# EAGLE design numpad (EAGLE 8.4.3)
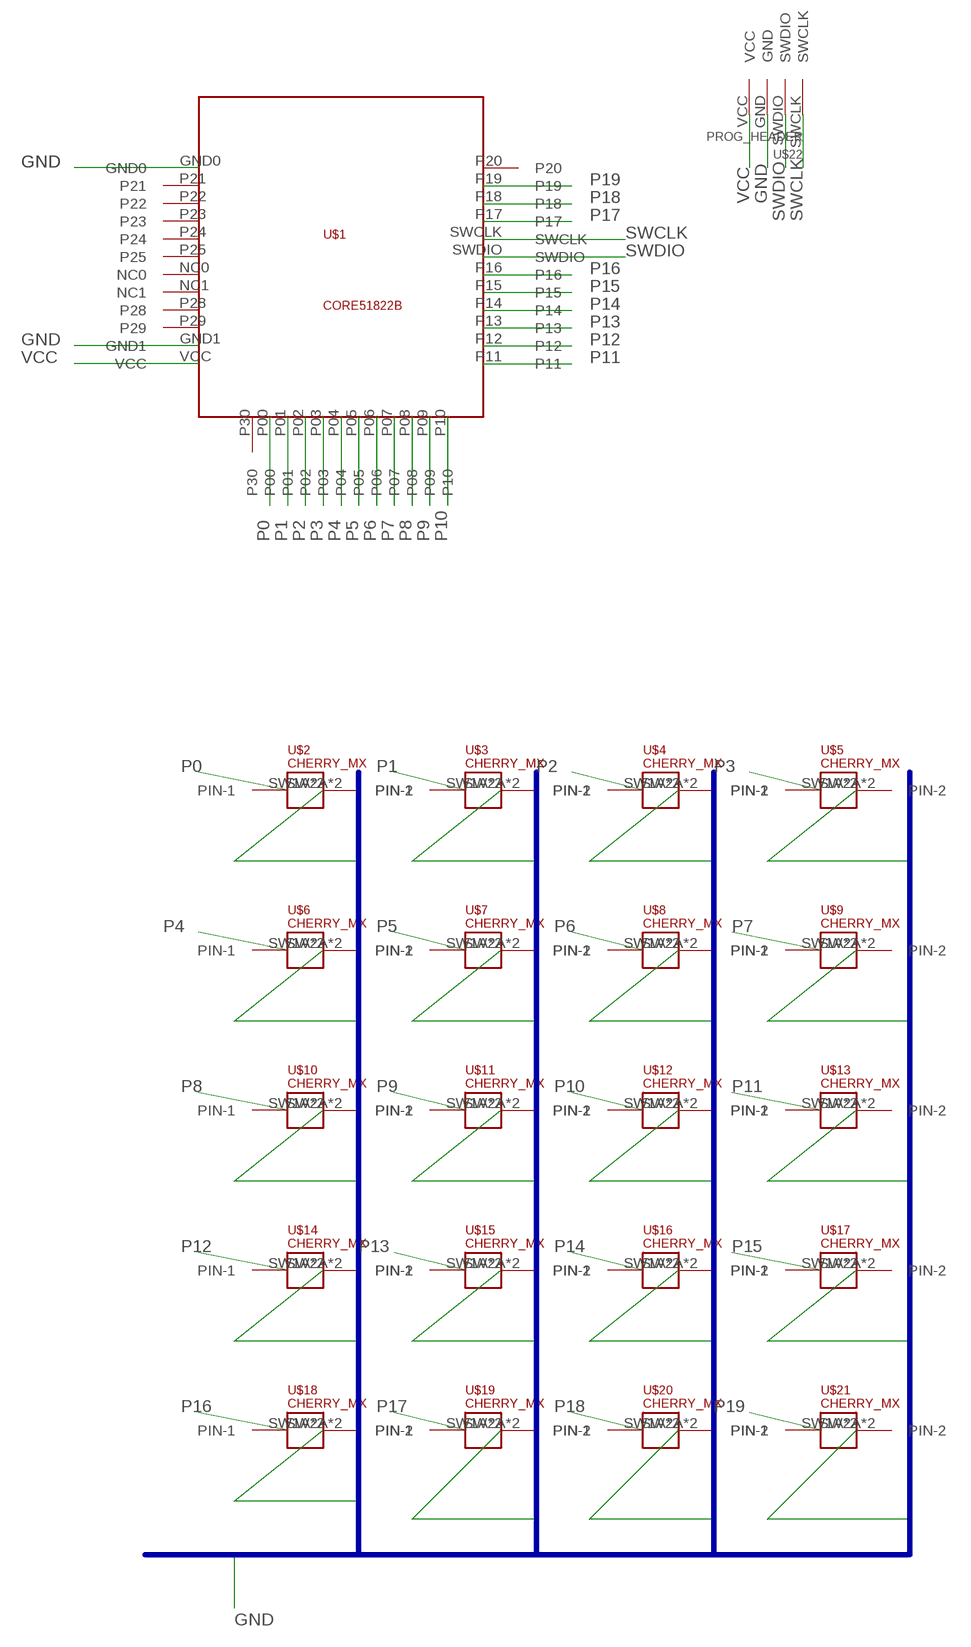
[diagram p0: schematic, sheet 1]

## Parts
U$1  CORE51822B  [CORE51822B]
U$2  CHERRY_MX  [CHERRY_MX]
U$3  CHERRY_MX  [CHERRY_MX]
U$4  CHERRY_MX  [CHERRY_MX]
U$5  CHERRY_MX  [CHERRY_MX]
U$6  CHERRY_MX  [CHERRY_MX]
U$7  CHERRY_MX  [CHERRY_MX]
U$8  CHERRY_MX  [CHERRY_MX]
U$9  CHERRY_MX  [CHERRY_MX]
U$10  CHERRY_MX  [CHERRY_MX]
U$11  CHERRY_MX  [CHERRY_MX]
U$12  CHERRY_MX  [CHERRY_MX]
U$13  CHERRY_MX  [CHERRY_MX]
U$14  CHERRY_MX  [CHERRY_MX]
U$15  CHERRY_MX  [CHERRY_MX]
U$16  CHERRY_MX  [CHERRY_MX]
U$17  CHERRY_MX  [CHERRY_MX]
U$18  CHERRY_MX  [CHERRY_MX]
U$19  CHERRY_MX  [CHERRY_MX]
U$20  CHERRY_MX  [CHERRY_MX]
U$21  CHERRY_MX  [CHERRY_MX]
U$22  PROG_HEADER  [PROG_HEADER]

## Nets
B$1: U$2.SW2A(PIN-2) U$2.SW2B(PIN-2) U$3.SW2A(PIN-2) U$3.SW2B(PIN-2) U$4.SW2A(PIN-2) U$4.SW2B(PIN-2) U$5.SW2A(PIN-2) U$5.SW2B(PIN-2) U$6.SW2A(PIN-2) U$6.SW2B(PIN-2) U$7.SW2A(PIN-2) U$7.SW2B(PIN-2) U$8.SW2A(PIN-2) U$8.SW2B(PIN-2) U$9.SW2A(PIN-2) U$9.SW2B(PIN-2) U$10.SW2A(PIN-2) U$10.SW2B(PIN-2) U$11.SW2A(PIN-2) U$11.SW2B(PIN-2) U$12.SW2A(PIN-2) U$12.SW2B(PIN-2) U$13.SW2A(PIN-2) U$13.SW2B(PIN-2) U$14.SW2A(PIN-2) U$14.SW2B(PIN-2) U$15.SW2A(PIN-2) U$15.SW2B(PIN-2) U$16.SW2A(PIN-2) U$16.SW2B(PIN-2) U$17.SW2A(PIN-2) U$17.SW2B(PIN-2) U$18.SW2A(PIN-2) U$18.SW2B(PIN-2) U$19.SW2A(PIN-2) U$19.SW2B(PIN-2) U$20.SW2A(PIN-2) U$20.SW2B(PIN-2) U$21.SW2A(PIN-2) U$21.SW2B(PIN-2)
GND: U$1.GND0 U$1.GND1 U$22.GND
P0: U$1.P00 U$2.SW1A(PIN-1) U$2.SW1B(PIN-1)
P1: U$1.P01 U$3.SW1A(PIN-1) U$3.SW1B(PIN-1)
P2: U$1.P02 U$4.SW1A(PIN-1) U$4.SW1B(PIN-1)
P3: U$1.P03 U$5.SW1A(PIN-1) U$5.SW1B(PIN-1)
P4: U$1.P04 U$6.SW1A(PIN-1) U$6.SW1B(PIN-1)
P5: U$1.P05 U$7.SW1A(PIN-1) U$7.SW1B(PIN-1)
P6: U$1.P06 U$8.SW1A(PIN-1) U$8.SW1B(PIN-1)
P7: U$1.P07 U$9.SW1A(PIN-1) U$9.SW1B(PIN-1)
P8: U$1.P08 U$10.SW1A(PIN-1) U$10.SW1B(PIN-1)
P9: U$1.P09 U$11.SW1A(PIN-1) U$11.SW1B(PIN-1)
P10: U$1.P10 U$12.SW1A(PIN-1) U$12.SW1B(PIN-1)
P11: U$1.P11 U$13.SW1A(PIN-1) U$13.SW1B(PIN-1)
P12: U$1.P12 U$14.SW1A(PIN-1) U$14.SW1B(PIN-1)
P13: U$1.P13 U$15.SW1A(PIN-1) U$15.SW1B(PIN-1)
P14: U$1.P14 U$16.SW1A(PIN-1) U$16.SW1B(PIN-1)
P15: U$1.P15 U$17.SW1A(PIN-1) U$17.SW1B(PIN-1)
P16: U$1.P16 U$18.SW1A(PIN-1) U$18.SW1B(PIN-1)
P17: U$1.P17 U$19.SW1A(PIN-1) U$19.SW1B(PIN-1)
P18: U$1.P18 U$20.SW1A(PIN-1) U$20.SW1B(PIN-1)
P19: U$1.P19 U$21.SW1A(PIN-1) U$21.SW1B(PIN-1)
SWCLK: U$1.SWCLK U$22.SWCLK
SWDIO: U$1.SWDIO U$22.SWDIO
VCC: U$1.VCC U$22.VCC
Unconnected: U$1.NC0 U$1.NC1 U$1.P20 U$1.P21 U$1.P22 U$1.P23 U$1.P24 U$1.P25 U$1.P28 U$1.P29 U$1.P30

## Buses
B$1

## Library data of the parts
U$1 = core51822b:CORE51822B: Core51822-b nRF51822 PCB
U$2-U$21 = cherry_mx:CHERRY_MX
U$22 = prog_header:PROG_HEADER

## Board
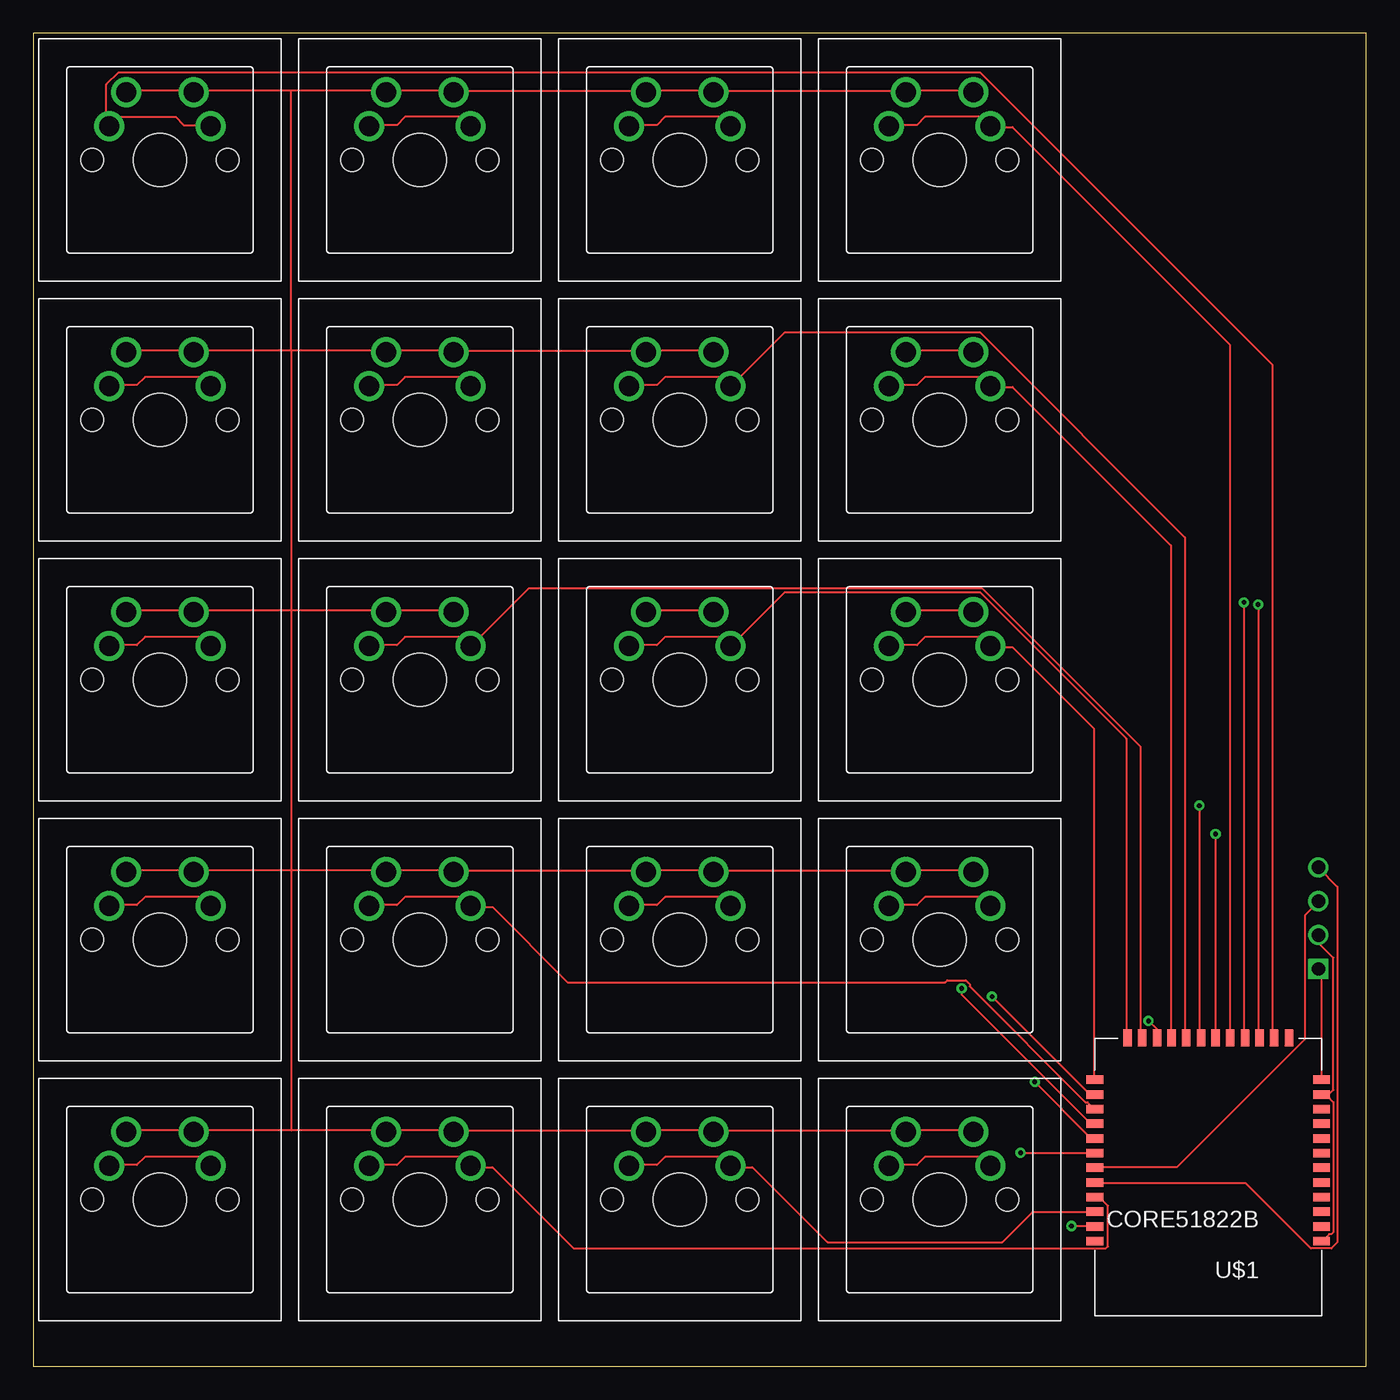
[diagram p1: board, top side]
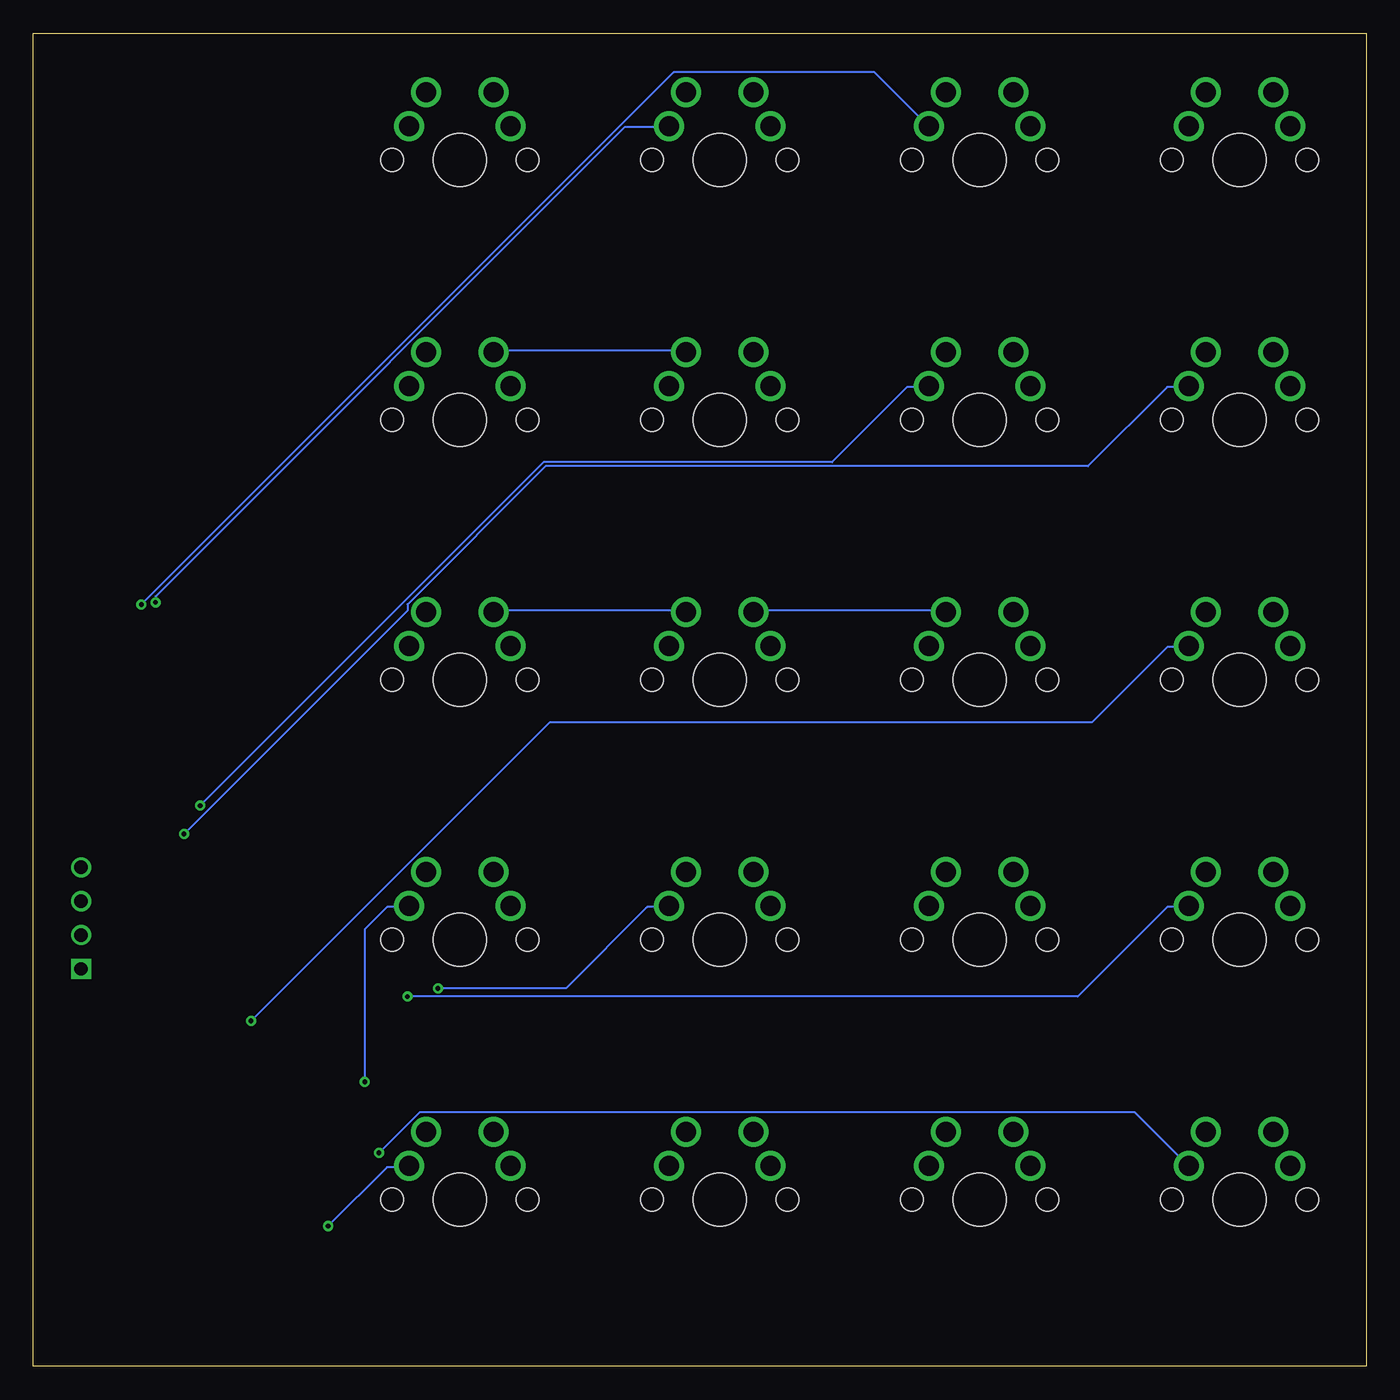
[diagram p2: board, bottom side, seen from below]

Size 100 x 100 mm. Coordinates in mm from the lower left corner, seen from the top.
Outline: 0,0 100,0 100,100 0,100 0,0
Copper layers (1*16): Top 0.035mm / dielectric 1.5mm / Bottom 0.035mm
Design rules "default": minimum track width 6mil, minimum drill 0.35mm, track to track 6mil, track to pad 6mil, pad to pad 6mil, via to via 6mil, smd to smd 6mil, copper to edge 40mil, drill to drill 6mil, minimum pad ring 10mil, minimum via ring 8mil, stop-mask expansion 4mil, vias tented up to drill 0mil, thermal gap 10mil

### Footprints (pad centres in the part's own frame; a part is rotated, then mirrored left to right if it is on the bottom)
CORE51822B = smd 1.27 x 0.635: GND0 -8.5,4.8; GND1 -8.5,-6.2; NC0 -8.5,-1.8; NC1 -8.5,-2.9; P11 8.5,-7.3; P12 8.5,-6.2; P13 8.5,-5.1; P14 8.5,-4; P15 8.5,-2.9; P16 8.5,-1.8; P17 8.5,1.5; P18 8.5,2.6; P19 8.5,3.7; P20 8.5,4.8; P21 -8.5,3.7; P22 -8.5,2.6; P23 -8.5,1.5; P24 -8.5,0.4; P25 -8.5,-0.7; P28 -8.5,-4; P29 -8.5,-5.1; SWCLK 8.5,0.4; SWDIO 8.5,-0.7; VCC -8.5,-7.3 | smd 0.635 x 1.27: P00 -4.95,-10.45; P01 -3.85,-10.45; P02 -2.75,-10.45; P03 -1.65,-10.45; P04 -0.55,-10.45; P05 0.55,-10.45; P06 1.65,-10.45; P07 2.75,-10.45; P08 3.85,-10.45; P09 4.95,-10.45; P10 6.05,-10.45; P30 -6.05,-10.45
CHERRY_MX = drill 1.499: SW1A 3.81,2.54; SW1B -3.81,2.54; SW2A -2.54,5.08; SW2B 2.54,5.08 | hole 3.988: 0,0 | hole 1.702: -5.08,0; 5.08,0
PROG_HEADER = drill 1: GND 0,-2.54; SWCLK 0,-7.62; SWDIO 0,-5.08 | drill 1 square: VCC 0,0

### Placement (x,y rotation side)
U$1  88.15,14.19 180 top
U$2  9.5,90.5 0 top
U$3  29,90.5 0 top
U$4  48.5,90.5 0 top
U$5  68,90.5 0 top
U$6  9.5,71 0 top
U$7  29,71 0 top
U$8  48.5,71 0 top
U$9  68,71 0 top
U$10  9.5,51.5 0 top
U$11  29,51.5 0 top
U$12  48.5,51.5 0 top
U$13  68,51.5 0 top
U$14  9.5,32 0 top
U$15  29,32 0 top
U$16  48.5,32 0 top
U$17  68,32 0 top
U$18  9.5,12.5 0 top
U$19  29,12.5 0 top
U$20  48.5,12.5 0 top
U$21  68,12.5 0 top
U$22  96.42,29.81 180 top

### Tracks (layer width: path | path; a pad name or v marks a point on that pad's centre or on a via)
B$1
  Top 0.152: U$21.SW2B 70.41,17.68 65.53,17.68 U$21.SW2A 65.38,17.68 51.05,17.68 U$20.SW2B 50.9,17.68 46.02,17.68 U$20.SW2A 45.87,17.68 31.55,17.68 U$19.SW2B 31.39,17.68 26.52,17.68 U$19.SW2A 26.36,17.68 19.36,17.68 | U$18.SW2A 7.01,17.68 12.04,17.68 U$18.SW2B 12.19,17.68 19.36,17.68 | U$17.SW2B 70.41,37.19 65.53,37.19 U$17.SW2A 65.38,37.19 51.05,37.19 U$16.SW2B 50.9,37.19 46.02,37.19 U$16.SW2A 45.87,37.19 31.55,37.19 U$15.SW2B 31.39,37.19 26.52,37.19 U$15.SW2A 26.36,37.19 19.36,37.19 | U$14.SW2A 7.01,37.19 12.04,37.19 U$14.SW2B 12.19,37.19 19.36,37.19 | 19.36,37.19 19.36,17.68 | U$5.SW2B 70.41,95.71 65.53,95.71 U$5.SW2A 65.38,95.71 51.05,95.71 U$4.SW2B 50.9,95.71 46.02,95.71 U$4.SW2A 45.87,95.71 31.55,95.71 U$3.SW2B 31.39,95.71 26.52,95.71 U$3.SW2A 26.36,95.71 19.36,95.71 | U$2.SW2A 7.01,95.71 12.04,95.71 U$2.SW2B 12.19,95.71 19.36,95.71 | U$13.SW2A 65.53,56.69 70.41,56.69 U$13.SW2B | U$12.SW2A 46.02,56.69 50.9,56.69 U$12.SW2B | U$10.SW2A 7.01,56.69 12.04,56.69 U$10.SW2B 12.19,56.69 19.36,56.69 | U$11.SW2B 31.39,56.69 26.52,56.69 U$11.SW2A 26.36,56.69 19.36,56.69 | U$9.SW2A 65.53,76.2 70.41,76.2 U$9.SW2B | U$8.SW2B 50.9,76.2 46.02,76.2 U$8.SW2A 45.87,76.2 31.55,76.2 U$7.SW2B 31.39,76.2 26.52,76.2 U$7.SW2A 26.36,76.2 19.36,76.2 | U$6.SW2A 7.01,76.2 12.04,76.2 U$6.SW2B 12.19,76.2 19.36,76.2 | 19.36,76.2 19.36,56.69 | 19.36,76.2 19.36,95.71 | 19.36,56.69 19.36,37.19
  Bottom 0.152: U$12.SW2A 45.87,56.69 31.55,56.69 U$11.SW2B | U$13.SW2A 65.38,56.69 51.05,56.69 U$12.SW2B | U$9.SW2A 65.38,76.2 51.05,76.2 U$8.SW2B
GND
  Top 0.152: 97.08,20.27 97.54,19.81 97.54,10.06 97.38,9.91 97.23,9.91 96.77,9.45 U$1.GND0 | 97.08,20.27 96.77,20.27 U$1.GND1 97.08,20.27 | 97.08,20.27 97.54,20.73 97.54,30.63 96.47,31.7 96.47,32.31 U$22.GND
P0
  Top 0.152: 5.49,93.73 5.49,93.27 5.64,93.12 U$2.SW1B 5.49,93.73 | 5.49,93.73 5.49,96.16 6.4,97.08 71.02,97.08 92.96,75.13 92.96,24.69 U$1.P00 | 5.49,93.73 10.67,93.73 11.28,93.12 13.26,93.12 U$2.SW1A
P1  (via drill 0.35)
  Top 0.152: v91.9,57.15 91.9,24.69 U$1.P01 | U$3.SW1B 25.3,93.12 27.28,93.12 27.89,93.73 32.16,93.73 32.77,93.12 U$3.SW1A
  Bottom 0.152: v91.9,57.15 51.97,97.08 36.88,97.08 32.92,93.12 U$3.SW1A
P2  (via drill 0.35)
  Top 0.152: v90.83,57.3 90.83,24.69 U$1.P02 | U$4.SW1B 44.81,93.12 46.79,93.12 47.4,93.73 51.66,93.73 52.27,93.12 U$4.SW1A
  Bottom 0.152: v90.83,57.3 90.83,57.76 55.63,92.96 52.43,92.96 U$4.SW1A
P3
  Top 0.152: U$1.P03 89.76,24.69 89.76,76.66 73.46,92.96 71.93,92.96 U$5.SW1A 71.78,93.12 71.17,93.73 66.9,93.73 66.29,93.12 64.31,93.12 U$5.SW1B
P4  (via drill 0.35)
  Top 0.152: v88.7,39.93 88.7,24.69 U$1.P04 | U$6.SW1B 5.79,73.61 7.77,73.61 8.38,74.22 12.65,74.22 13.26,73.61 U$6.SW1A
  Bottom 0.152: v88.7,39.93 71.93,56.69 71.93,57.15 61.57,67.51 20.88,67.51 14.94,73.46 13.41,73.46 U$6.SW1A
P5  (via drill 0.35)
  Top 0.152: v87.48,42.06 87.48,24.69 U$1.P05 | U$7.SW1B 25.3,73.61 27.28,73.61 27.89,74.22 32.16,74.22 32.77,73.61 U$7.SW1A
  Bottom 0.152: v87.48,42.06 61.72,67.82 40.08,67.82 34.44,73.46 32.92,73.46 U$7.SW1A
P6
  Top 0.152: U$1.P06 86.41,24.69 86.41,62.18 71.02,77.57 56.39,77.57 52.43,73.61 U$8.SW1A 52.27,73.61 51.66,74.22 47.4,74.22 46.79,73.61 44.81,73.61 U$8.SW1B
P7
  Top 0.152: U$1.P07 85.34,24.69 85.34,61.57 73.46,73.46 71.93,73.46 U$9.SW1A 71.78,73.61 71.17,74.22 66.9,74.22 66.29,73.61 64.31,73.61 U$9.SW1B
P8  (via drill 0.35)
  Top 0.152: v83.67,25.91 84.28,25.3 84.28,24.69 U$1.P08 | U$10.SW1B 5.79,54.1 7.77,54.1 8.38,54.71 12.65,54.71 13.26,54.1 U$10.SW1A
  Bottom 0.152: v83.67,25.91 61.27,48.31 20.57,48.31 14.94,53.95 13.41,53.95 U$10.SW1A
P9
  Top 0.152: U$1.P09 83.06,24.69 83.06,46.48 71.17,58.37 37.19,58.37 32.92,54.1 U$11.SW1A 32.77,54.1 32.16,54.71 27.89,54.71 27.28,54.1 25.3,54.1 U$11.SW1B
P10
  Top 0.152: U$1.P10 81.99,24.69 81.99,47.09 71.02,58.06 56.39,58.06 52.43,54.1 U$12.SW1A 52.27,54.1 51.66,54.71 47.4,54.71 46.79,54.1 44.81,54.1 U$12.SW1B
P11
  Top 0.152: U$1.P11 79.55,21.64 79.55,47.85 73.46,53.95 71.93,53.95 U$13.SW1A 71.78,54.1 71.17,54.71 66.9,54.71 66.29,54.1 64.31,54.1 U$13.SW1B
P12  (via drill 0.35)
  Top 0.152: v71.93,27.74 79.25,20.42 79.55,20.42 U$1.P12 | U$14.SW1B 5.79,34.59 7.77,34.59 8.38,35.2 12.65,35.2 13.26,34.59 U$14.SW1A
  Bottom 0.152: v71.93,27.74 21.64,27.74 14.94,34.44 13.41,34.44 U$14.SW1A
P13
  Top 0.152: U$1.P13 79.55,19.36 79.1,19.81 78.94,19.81 70.26,28.5 70.26,28.65 69.95,28.96 68.58,28.96 68.43,28.8 40.08,28.8 34.44,34.44 32.92,34.44 U$15.SW1A 32.77,34.59 32.16,35.2 27.89,35.2 27.28,34.59 25.3,34.59 U$15.SW1B
P14  (via drill 0.35)
  Top 0.152: v69.65,28.35 69.65,27.89 79.25,18.29 79.55,18.29 U$1.P14 | U$16.SW1B 44.81,34.59 46.79,34.59 47.4,35.2 51.66,35.2 52.27,34.59 U$16.SW1A
  Bottom 0.152: v69.65,28.35 60.05,28.35 53.95,34.44 52.43,34.44 U$16.SW1A
P15  (via drill 0.35)
  Top 0.152: v75.13,21.34 79.25,17.22 79.55,17.22 U$1.P15 | U$17.SW1B 64.31,34.59 66.29,34.59 66.9,35.2 71.17,35.2 71.78,34.59 U$17.SW1A
  Bottom 0.152: v75.13,21.34 75.13,32.77 73.46,34.44 71.93,34.44 U$17.SW1A
P16  (via drill 0.35)
  Top 0.152: v74.07,16 79.55,16 U$1.P16 | U$18.SW1B 5.79,15.09 7.77,15.09 8.38,15.7 12.65,15.7 13.26,15.09 U$18.SW1A
  Bottom 0.152: v74.07,16 71.02,19.05 17.37,19.05 13.41,15.09 U$18.SW1A
P17
  Top 0.152: U$1.P17 79.7,12.65 80.01,12.65 80.62,12.04 80.62,8.99 80.47,8.84 40.54,8.84 34.44,14.94 32.92,14.94 U$19.SW1A 32.77,15.09 32.16,15.7 27.89,15.7 27.28,15.09 25.3,15.09 U$19.SW1B
P18
  Top 0.152: U$1.P18 79.55,11.58 74.98,11.58 72.69,9.3 59.59,9.3 53.95,14.94 52.43,14.94 U$20.SW1A 52.27,15.09 51.66,15.7 47.4,15.7 46.79,15.09 44.81,15.09 U$20.SW1B
P19  (via drill 0.35)
  Top 0.152: v77.88,10.52 79.55,10.52 U$1.P19 | U$21.SW1B 64.31,15.09 66.29,15.09 66.9,15.7 71.17,15.7 71.78,15.09 U$21.SW1A
  Bottom 0.152: v77.88,10.52 73.46,14.94 71.93,14.94 U$21.SW1A
SWCLK
  Top 0.152: U$1.SWCLK 79.7,13.72 90.98,13.72 95.86,8.84 97.38,8.84 97.84,9.3 97.84,35.97 96.47,37.34 U$22.SWCLK
SWDIO
  Top 0.152: U$1.SWDIO 79.7,14.94 85.8,14.94 95.4,24.54 95.4,33.83 96.32,34.75 U$22.SWDIO
VCC
  Top 0.152: U$1.VCC 96.62,21.64 96.62,29.57 96.47,29.72 U$22.VCC